# EasyEDA Pro project ProPrj_Y车Y形板_2025-09-30.epro, schematic DRV_1
Board Name: 带保护芯片; Create Date: 2025-06-02; Page Name: P1; Project Name: Y车Y形板; Schematic Name: DRV_1; Update Date: 2025-06-03; Company: 嘉立创EDA; Page Size: A4; Version: V1.0
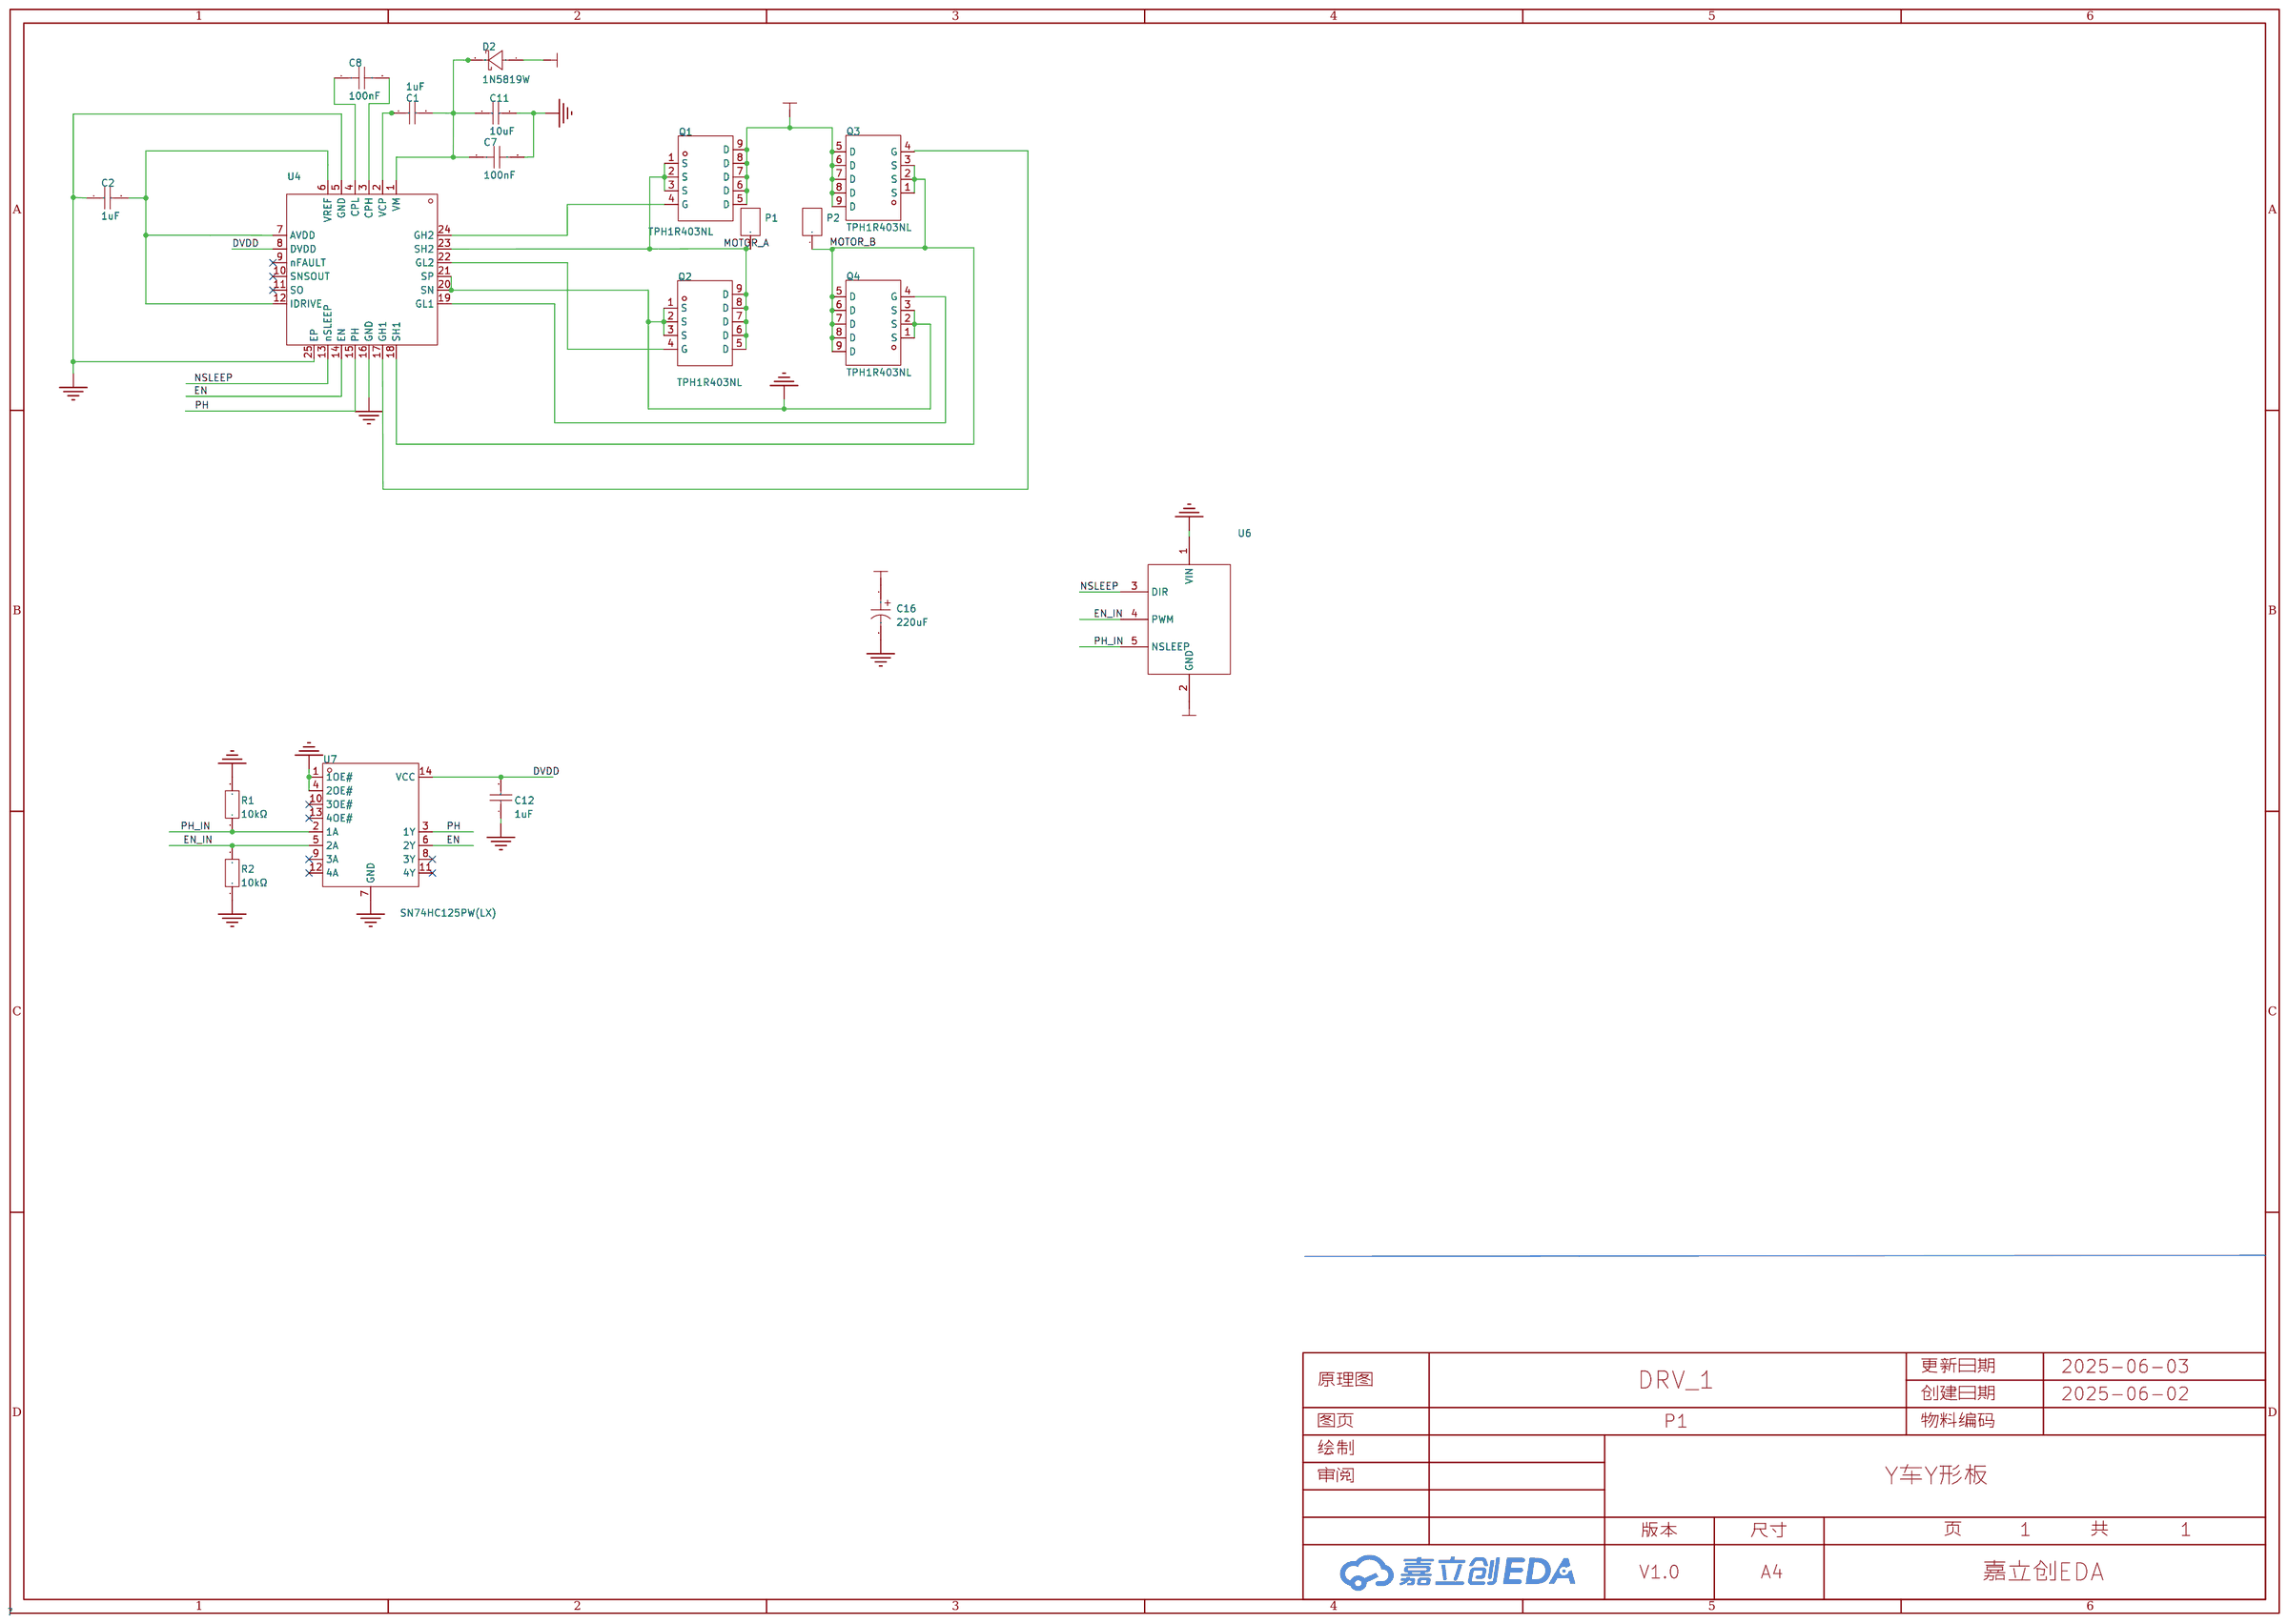
[diagram p4: schematic sheet]

## Parts
C1  1uF  [C0805]
C2  1uF  [C0805]
C7  100nF  [C0805]
C8  100nF  [C0805]
C11  10uF  [C0805]
C12  1uF  [C0805]
C16  220uF  [CAP-SMD_BD6.3-L6.6-W6.6-FD]
D2  1N5819W  [SOD-123_L2.7-W1.6-LS3.7-R-RD]
P1  WirePad  [WirePad-4x6]
P2  WirePad  [WirePad-4x6]
Q1  TPH1R403NL  [DSOP-8_L5.0-W5.0-P1.27-LS6.0-BL-EP]
Q2  TPH1R403NL  [DSOP-8_L5.0-W5.0-P1.27-LS6.0-BL-EP]
Q3  TPH1R403NL  [DSOP-8_L5.0-W5.0-P1.27-LS6.0-BL-EP]
Q4  TPH1R403NL  [DSOP-8_L5.0-W5.0-P1.27-LS6.0-BL-EP]
R1  10kΩ  [R0603]
R2  10kΩ  [R0603]
U4  DRV8701ERGET  [VQFN-24_L4.0-W4.0-P0.50-BL-EP2.5]
U6  -  [DRV8701连接焊盘]
U7  SN74HC125PW(LX)  [TSSOP-14_L5.0-W4.4-P0.65-LS6.4-BL]

## Library data of the parts
C1 C2 C12 = CL21F105ZOFNNNE: 容值:1uF;精度:-20%~+80%;额定电压:16V;材质(温度系数):Y5V;; LCSC Part Name: 1uF -20%~+80% 16V; Supplier Part: C16834; Manufacturer: SAMSUNG(三星); Supplier Footprint: 0805; Datasheet: https://atta.szlcsc.com/upload/public/pdf/source/20160218/1457707763339.pdf; Supplier: LCSC; Tolerance: -20%~+80%; Voltage Rated: 16V; Temperature Coefficient: Y5V
C7 C8 = CL21B104MBCNNNC: 容值:100nF;精度:±20%;额定电压:50V;材质(温度系数):X7R;; LCSC Part Name: 100nF ±20% 50V; Supplier Part: C730459; Manufacturer: SAMSUNG(三星); Supplier Footprint: 0805; JLCPCB Part Class: 扩展库; Datasheet: https://atta.szlcsc.com/upload/public/pdf/source/20200826/C730450_29CB8D8852DE4570E7C78FF52F4A7792.pdf; Supplier: LCSC; Tolerance: ±20%; Voltage Rated: 50V; Temperature Coefficient: X7R
C11 = C2012X5R1E106KT000N: 容值:10uF;精度:±10%;额定电压:25V;材质(温度系数):X5R;; LCSC Part Name: 10uF ±10% 25V; Supplier Part: C329933; Manufacturer: TDK; Supplier Footprint: 0805; Datasheet: https://atta.szlcsc.com/upload/public/pdf/source/20190114/C363926_7E597D123A0E7E55734060CC1336CCA3.pdf; Supplier: LCSC; Tolerance: ±10%; Voltage Rated: 25V; Temperature Coefficient: X5R
C16 = 01EC3470: 容值:220uF;精度:±20%;额定电压:50V;纹波电流:350mA@120kHz;等效串联电阻:-;; LCSC Part Name: 220uF ±20% 50V; Supplier Part: C2836445; Manufacturer: KNSCHA(科尼盛); Supplier Footprint: 插件,D8xL12mm; JLCPCB Part Class: 扩展库; Datasheet: https://atta.szlcsc.com/upload/public/pdf/source/20210528/C2836445_4EB3DEC3C45633977FB5495C9B2E1697.pdf; Supplier: LCSC; Tolerance: ±20%; Rated Voltage: 50V; Ripple Current: 350mA@120kHz; Lead Spacing: 3.5mm; φD: 8mm; L: 12mm; Lifetime @ Temp: 2000hrs@105℃; Operating Temperature: -40℃~+105℃
D2 = 1N5819W_C963381: 二极管配置:独立式;正向压降(Vf):600mV@200mA;直流反向耐压(Vr):40V;平均整流电流(Io):350mA;; LCSC Part Name: 电压:40V 电流:350mA; Supplier Part: C963381; Manufacturer: JSMSEMI(杰盛微); Supplier Footprint: SOD-123; JLCPCB Part Class: 扩展库; Datasheet: https://atta.szlcsc.com/upload/public/pdf/source/20230807/ADD53622154D5B572F84A7B877E922CE.pdf; Supplier: LCSC; Diode Configuration: 独立式; Forward Voltage (Vf@If): 600mV@200mA; Reverse Voltage (Vr): 40V; Average Rectified Current (Io): 350mA; Reverse Leakage Current (Ir): 5uA@30V
P1 P2 = WirePad: Origin Footprint 2: WirePad-4.5x7
Q1-Q4 = TPH1R403NL_C83440: 类型:N沟道;漏源电压(Vdss):30V;连续漏极电流(Id):150A;功率(Pd):64W;导通电阻(RDS(on)@Vgs,Id):1.4mΩ@10V,30A;阈值电压(Vgs(th)@Id):2.3V@500uA;; LCSC Part Name: N沟道 耐压:30V 电流:150A; Supplier Part: C83440; Manufacturer: TOSHIBA(东芝); Supplier Footprint: DSOP-8-EP-5.0mm; JLCPCB Part Class: 扩展库; Datasheet: https://atta.szlcsc.com/upload/public/pdf/source/20170908/C83440_1504870121708958077.pdf; Supplier: LCSC; Type: N沟道; Drain Source Voltage (Vdss): 30V; Continuous Drain Current (Id): 150A; Power Dissipation (Pd): 64W; Drain Source On Resistance (RDS(on)@Vgs,Id): 1.4mΩ@10V,30A; Gate Threshold Voltage (Vgs(th)@Id): 2.3V@500uA
R1 R2 = FRC0603J103TS: 电阻类型:厚膜电阻;阻值:10kΩ;精度:±5%;功率:100mW;最大工作电压:75V;温度系数:±100ppm/℃;; LCSC Part Name: 10kΩ ±5% 100mW 厚膜电阻; Supplier Part: C2930027; Manufacturer: FOJAN(富捷); Supplier Footprint: 0603; JLCPCB Part Class: 扩展库; Datasheet: https://atta.szlcsc.com/upload/public/pdf/source/20211221/925EC7D7225764EE0046F22065062C87.pdf; Supplier: LCSC; Type: 厚膜电阻; Tolerance: ±5%; Power(Watts): 100mW; Overload Voltage (Max): 75V; Temperature Coefficient: ±100ppm/℃; Operating Temperature Range: -55℃~+155℃
U4 = DRV8701ERGET: 驱动电机类型:有刷直流电机;电源电压:0V~5.5V;输出电流:-;接口:并行;; LCSC Part Name: 有刷直流电机驱动芯片 5.5V; Supplier Part: C132049; Manufacturer: TI(德州仪器); Supplier Footprint: VQFN-24(4x4); Datasheet: https://www.ti.com/cn/lit/gpn/drv8701; Supplier: LCSC; Drive motor type: 有刷直流电机; Supply Voltage: 0V~5.5V; Interface: 并行; Operating Temperature: -40℃~+125℃@(Ta)
U6 = DRV8901驱动连接焊盘
U7 = SN74HC125PW(LX): 电源电压:2V~6V;; LCSC Part Name: 集成电路; Supplier Part: C22436985; Manufacturer: LX(灵星芯微); Supplier Footprint: TSSOP-14; JLCPCB Part Class: 扩展库; Datasheet: https://atta.szlcsc.com/upload/public/pdf/source/20240524/1C5159D7226ED4E43AF91C2F847C0932.pdf; Supplier: LCSC; output type: 三态; Supply Voltage: 2V~6V; Logic Family: 74HC; Operating Temperature: -40℃~+105℃

## Nets
DVDD: C12.2 U4.8(DVDD) U7.14(VCC)
GND: C2.1 C7.2 C11.2 C12.1 C16.2 Q2.1(S) Q2.2(S) Q2.3(S) Q4.1(S) Q4.2(S) Q4.3(S) R1.2 R2.1 U4.5(GND) U4.16(GND) U4.20(SN) U4.21(SP) U4.25(EP) U6.1(VIN) U7.1(1OE#) U7.4(2OE#) U7.7(GND)
VIN: C16.1 D2.1(A) Q1.5(D) Q1.6(D) Q1.7(D) Q1.8(D) Q1.9(D) Q3.5(D) Q3.6(D) Q3.7(D) Q3.8(D) Q3.9(D) U6.2(GND)
EN: U4.14(EN) U7.6(2Y)
EN_IN: R2.2 U6.4(PWM) U7.5(2A)
MOTOR_A: P1.1 Q1.1(S) Q1.2(S) Q1.3(S) Q2.5(D) Q2.6(D) Q2.7(D) Q2.8(D) Q2.9(D) U4.23(SH2)
MOTOR_B: P2.1 Q3.1(S) Q3.2(S) Q3.3(S) Q4.5(D) Q4.6(D) Q4.7(D) Q4.8(D) Q4.9(D) U4.18(SH1)
NSLEEP: U4.13(nSLEEP) U6.3(DIR)
PH: U4.15(PH) U7.3(1Y)
PH_IN: R1.1 U6.5(NSLEEP) U7.2(1A)
$1N8377: C1.1 U4.2(VCP)
$1N8380: C8.2 U4.3(CPH)
$1N8381: C8.1 U4.4(CPL)
$1N8402: Q1.4(G) U4.24(GH2)
$1N8405: Q2.4(G) U4.22(GL2)
$1N8407: Q4.4(G) U4.19(GL1)
$1N8411: C1.2 C7.1 C11.1 D2.2(C) U4.1(VM)
$1N14151: C2.2 U4.6(VREF) U4.7(AVDD) U4.12(IDRIVE)
$1N14297: Q3.4(G) U4.17(GH1)

Not connected (* = marked no-connect by the designer): U4 9(nFAULT)* 10(SNSOUT)* 11(SO)*; U7 8(3Y)* 9(3A)* 10(3OE#)* 11(4Y)* 12(4A)* 13(4OE#)*
